# Altium project SLAVE.PrjPcb
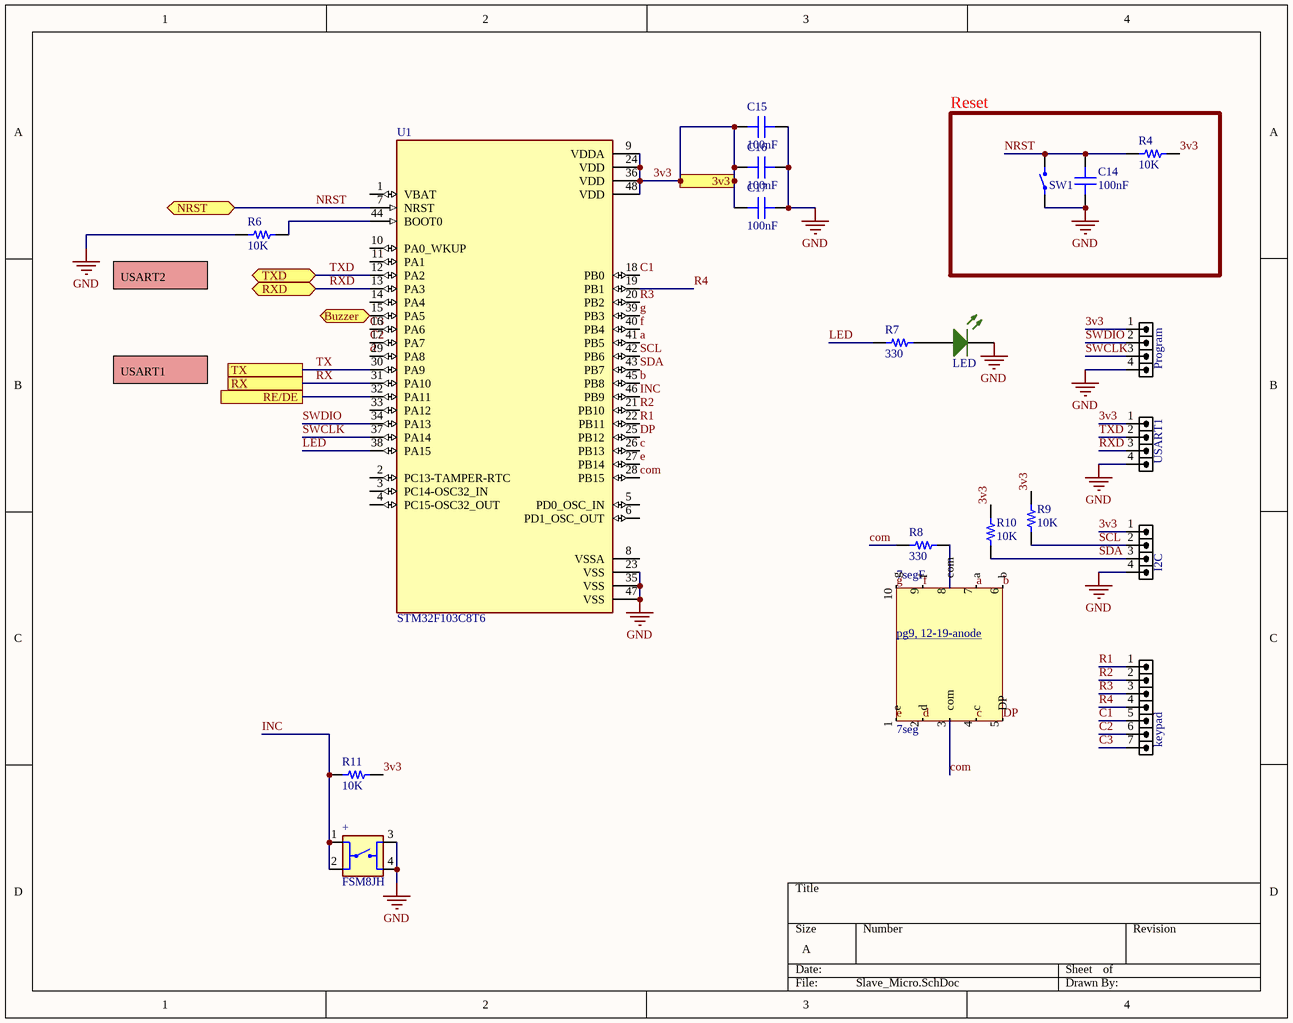
[diagram p0: Slave_Micro.SchDoc]
5 sheets, 57 parts. Net scope: flat (ports and power ports of the same name join across sheets).
Board file: SLAVE.PcbDoc
Sheets:
  Slave_Micro.SchDoc
  CH340G.SchDoc
  MAX485.SchDoc
  Supply 5V to 3V3- Ams1117.SchDoc
  Buzzer.SchDoc

## Sheet Slave_Micro.SchDoc
size A

### Parts
7seg  7seg  [PCBComponent_1]  (part F of 6)
+  FSM8JH  [SW_FSM8JH]
C14  100nF  [CAP 0805_2012]
C15  100nF  [CAP 0805_2012]
C16  100nF  [CAP 0805_2012]
C17  100nF  [CAP 0805_2012]
I2C  HDR1X4  [HDR_1X4]  (value not drawn)
keypad  HDR1X7  [HDR_1X7]  (value not drawn)
LED  LED SMD 0805 GREEN  [LED_0805_GREEN]  (value not drawn)
Program  HDR1X4  [HDR_1X4]  (value not drawn)
R4  10K  [RES 0805_2012]
R6  10K  [RES 0805_2012]
R7  330  [RES 0805_2012]
R8  330  [RES 0805_2012]
R9  10K  [RES 0805_2012]
R10  10K  [RES 0805_2012]
R11  10K  [RES 0805_2012]
SW1  Tactile 2PIN 6X3.5mm H4.57mm (SMD)  [SWPBS_SPST_6X3X5]  (value not drawn)
U1  STM32F103C8T6  [QFP50P900X900X160-48N]
USART1  HDR1X4  [HDR_1X4]  (value not drawn)

### Blocks framed on the sheet
Reset: C14 R4 SW1

### Ports
3v3 (in), Buzzer (bidir), NRST (bidir), RE/DE, RX, RXD (bidir), TX, TXD (bidir)

### Nets
GND: +.3 +.4 C14.1 C15.1 C16.1 C17.1 I2C.4 LED.2(K) Program.4 R6.1 SW1.1 U1.23(VSS) U1.35(VSS) U1.47(VSS) USART1.4
3v3: C15.2 C16.2 C17.2 I2C.1 Program.1 R4.2 R9.2 R10.2 R11.2 U1.9(VDDA) U1.24(VDD) U1.36(VDD) U1.48(VDD) USART1.1 ; port 3v3
a: 7seg.7(a) U1.41(PB5)
b: 7seg.6(b) U1.45(PB8)
c: 7seg.4(c) U1.26(PB13)
C1: keypad.5 U1.18(PB0)
C2: keypad.6 U1.17(PA7)
C3: keypad.7 U1.16(PA6)
com: 7seg.3(com) R8.1 U1.28(PB15)
d: 7seg.2(d) U1.29(PA8)
DP: 7seg.5(DP) U1.25(PB12)
e: 7seg.1(e) U1.27(PB14)
f: 7seg.9(f) U1.40(PB4)
g: 7seg.10(g) U1.39(PB3)
INC: +.1 +.2 R11.1 U1.46(PB9)
LED: R7.1 U1.38(PA15)
NRST: C14.2 R4.1 SW1.2 U1.7(NRST) ; port NRST
R1: keypad.1 U1.22(PB11)
R2: keypad.2 U1.21(PB10)
R3: keypad.3 U1.20(PB2)
R4: keypad.4 U1.19(PB1)
RX: U1.31(PA10) ; port RX
RXD: U1.13(PA3) USART1.3 ; port RXD
SCL: I2C.2 R9.1 U1.42(PB6)
SDA: I2C.3 R10.1 U1.43(PB7)
SWCLK: Program.3 U1.37(PA14)
SWDIO: Program.2 U1.34(PA13)
TX: U1.30(PA9) ; port TX
TXD: U1.12(PA2) USART1.2 ; port TXD
Net7seg_8: 7seg.8(com) R8.2
NetLED_1: LED.1(A) R7.2
NetR6_2: R6.2 U1.44(BOOT0)
NetR20_1: U1.15(PA5) ; port Buzzer
NetR66_1: U1.32(PA11) ; port RE/DE

Not connected (* = marked no-connect by the designer): U1 1(VBAT) 2(PC13-TAMPER-RTC) 3(PC14-OSC32_IN) 4(PC15-OSC32_OUT) 5(PD0_OSC_IN) 6(PD1_OSC_OUT) 8(VSSA) 10(PA0_WKUP) 11(PA1) 14(PA4) 33(PA12)

### Notes on the sheet
- (near R6) USART2
- USART1
- (in symbol 7seg, part F) pg9, 12-19-anode

### Library data of the parts
7seg = 7seg: file:///C:/Users/Tamana/Downloads/7SEG-12-19mm-GREEN-ANOD.pdf
+ = FSM8JH: Tactile Switch SPST-NO Top Actuated Through Hole; MF: TE Connectivity; Check_prices: https://www.snapeda.com/parts/FSM8JH/TE+Connectivity+ALCOSWITCH+Switches/view-part/?ref=eda; Value: *; Availability: In Stock; MP: FSM8JH; Price: None; Package: None; SnapEDA_Link: https://www.snapeda.com/parts/FSM8JH/TE+Connectivity+ALCOSWITCH+Switches/view-part/?ref=snap
C14-C17 = Cap 0805: SMT Capacitor; VALUE: 100nF
I2C Program USART1 = HDR_1X4: CONN, HEADER, Male, pitch: 2.54mm, 4POS; VALUE: HDRM4
keypad = HDR_1X7: CONN, HEADER, Male, pitch: 2.54mm, 7POS; VALUE: HDRM7
R4 R6-R11 = Res 0805: SMT Resistor; VALUE: 1K
SW1 = Tactile 2PIN 6X3.5mm H4.57mm (SMD): Tactile Switch SPST-NO Top Actuated Surface Mount; PartNumber: FSMSMTR-ND
U1 = STM32F103C8T6: ARM® Cortex®-M3 STM32F1 Microcontroller IC 32-Bit 72MHz 64KB (64K x 8) FLASH 48-LQFP (7x7); MF: STMicroelectronics; SnapEDA_Link: https://www.snapeda.com/parts/STM32F103C8T6/STMicroelectronics/view-part/?ref=snap; Package: LQFP-48 STMicroelectronics; Value: *; MP: STM32F103C8T6; Check_prices: https://www.snapeda.com/parts/STM32F103C8T6/STMicroelectronics/view-part/?ref=eda

## Sheet CH340G.SchDoc
size A
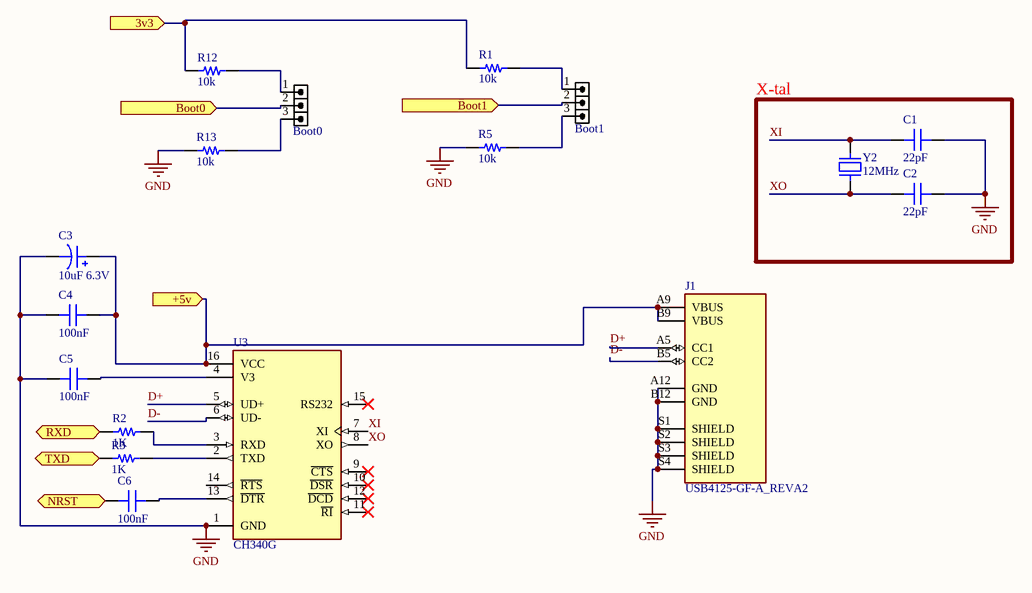
[diagram p1: CH340G.SchDoc]

### Parts
Boot0  HDRM3  [HDR_1X3]  (value not drawn)
Boot1  HDRM3  [HDR_1X3]  (value not drawn)
C1  22pF  [CAP 0805_2012]
C2  22pF  [CAP 0805_2012]
C3  10uF 6.3V  [CAP ALTH D8 L3.5 H12.5]
C4  100nF  [CAP 0805_2012]
C5  100nF  [CAP 0805_2012]
C6  100nF  [CAP 0805_2012]
J1  USB4125-GF-A_REVA2  [GCT_USB4125-GF-A_REVA2]
R1  10k  [RES 0805_2012]
R2  1K  [RES 0805_2012]
R3  1K  [RES 0805_2012]
R5  10k  [RES 0805_2012]
R12  10k  [RES 0805_2012]
R13  10k  [RES 0805_2012]
U3  CH340G  [SOIC127P600X180-16N]
Y2  12MHz  [HC-49S SMD]

### Blocks framed on the sheet
X-tal: C1 C2 Y2

### Ports
3v3 (in), +5v (in), Boot0 (in), Boot1 (in), NRST (bidir), RXD (bidir), TXD (bidir)

### Nets
GND: C1.2 C2.2 C3.2 C4.2 C5.1 J1.A12(GND) J1.B12(GND) J1.S1(SHIELD) J1.S2(SHIELD) J1.S3(SHIELD) J1.S4(SHIELD) R5.1 R13.1 U3.1(GND)
3v3: R1.1 R12.1 ; port 3v3
D+: J1.A5(CC1) U3.5(UD+)
D-: J1.B5(CC2) U3.6(UD-)
NRST: C6.1 ; port NRST
RXD: R2.1 ; port RXD
TXD: R3.1 ; port TXD
XI: C1.1 U3.7(XI) Y2.2
XO: C2.1 U3.8(XO) Y2.1
NetBoot0_1: Boot0.1 R12.2
NetBoot0_2: Boot0.2 ; port Boot0
NetBoot0_3: Boot0.3 R13.2
NetBoot1_1: Boot1.1 R1.2
NetBoot1_2: Boot1.2 ; port Boot1
NetBoot1_3: Boot1.3 R5.2
NetC3_1: C3.1 C4.1 J1.A9(VBUS) J1.B9(VBUS) U3.16(VCC) ; port +5v
NetC5_2: C5.2 U3.4(V3)
NetC6_2: C6.2 U3.13(~{DTR})
NetR2_2: R2.2 U3.3(RXD)
NetR3_2: R3.2 U3.2(TXD)

Not connected (* = marked no-connect by the designer): U3 9(~{CTS})* 10(~{DSR})* 11(~{RI})* 12(~{DCD})* 14(~{RTS}) 15(RS232)*

### Library data of the parts
Boot0 Boot1 = HDR_1X3: CONN, HEADER, Male, pitch: 2.54mm, 3POS; VALUE: HDRM3
C1 C2 = Cap 0805: SMT Capacitor; VALUE: 100nF
C3 = Cap Alu TH D8mm L3.5mm H12.5mm: TH Aluminum Polymer Capacitor; VALUE: 10uF 6.3V
C4-C6 = Cap 0805: SMT Capacitor; VALUE: 100nF
R1 R5 R12 R13 = Res 0805: SMT Resistor; VALUE: 1K
R2 R3 = Res 0805: SMT Resistor; VALUE: 1K
U3 = CH340G: USB Interface Integrated Circuit; MF: WCH; Value: *; SnapEDA_Link: https://www.snapeda.com/parts/Ch340G/WCH/view-part/?ref=snap; MP: Ch340G; Check_prices: https://www.snapeda.com/parts/Ch340G/WCH/view-part/?ref=eda; Availability: Not in stock; Price: None; Package: None
Y2 = Crystal HC-49S SMD 8MHz: SMT Crystal; PartNumber: ABLS-8.000MHZ-K4T
J1 = USB4125-GF-A_REVA2: Package: None; Availability: Unavailable; MP: USB4125-GF-A_REVA2; Value: *; Price: None

## Sheet MAX485.SchDoc
size A
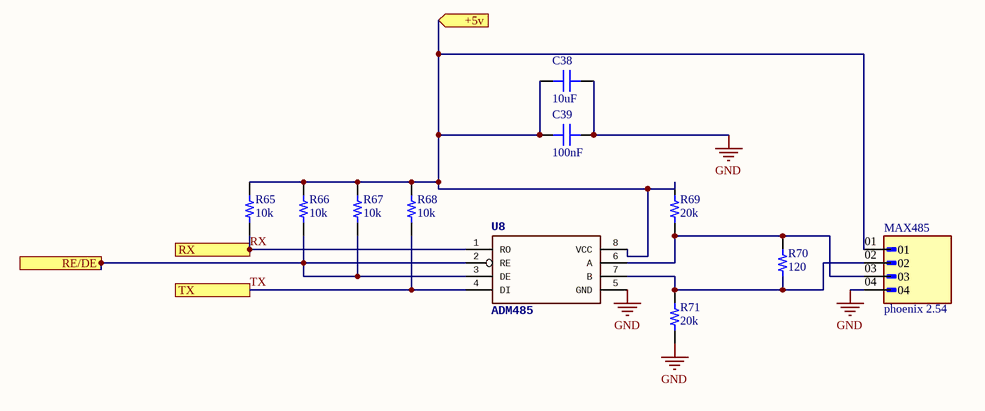
[diagram p2: MAX485.SchDoc]

### Parts
C38  10uF  [CAP 0805_2012]
C39  100nF  [CAP 0805_2012]
MAX485  phoenix 2.54  [PHOENIX_1881574]
R65  10k  [RES 0805_2012]
R66  10k  [RES 0805_2012]
R67  10k  [RES 0805_2012]
R68  10k  [RES 0805_2012]
R69  20k  [RES 0805_2012]
R70  120  [RES 0805_2012]
R71  20k  [RES 0805_2012]
U8  ADM485  [SOIC-8 4.9X3.9MM P1.27MM]

### Ports
+5v (in), RE/DE, RX, TX

### Nets
GND: C38.2 C39.2 MAX485.04 R71.1 U8.5(GND)
RX: R65.1 U8.1(RO) ; port RX
TX: R68.1 U8.4(DI) ; port TX
NetC3_1: C38.1 C39.1 MAX485.01 R65.2 R66.2 R67.2 R68.2 R69.2 U8.8(VCC) ; port +5v
NetMAX485_02: MAX485.02 R70.1 R71.2 U8.7(B)
NetMAX485_03: MAX485.03 R69.1 R70.2 U8.6(A)
NetR66_1: R66.1 R67.1 U8.2(RE) U8.3(DE) ; port RE/DE

### Library data of the parts
C38 = Cap 0805: SMT Capacitor; VALUE: 100nF
C39 = Cap 0805: SMT Capacitor; VALUE: 100nF
MAX485 = 1881574: MF: {'manufacturer': u'Phoenix Contact'}; Package: None; Price: None; Value: *; MP: 1881574; Availability: Unavailable
R65-R71 = Res 0805: SMT Resistor; VALUE: 1K
U8 = ADM485 (SMD): RS485 Interface; PartNumber: ADM4853ARZ-REEL7

## Sheet Supply 5V to 3V3- Ams1117.SchDoc
size A
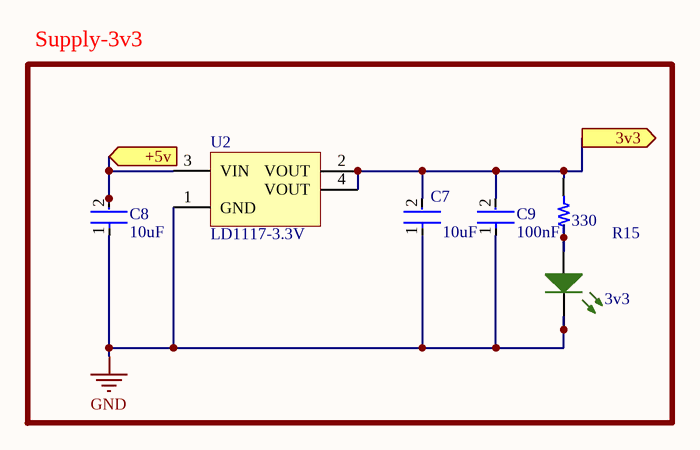
[diagram p3: Supply 5V to 3V3- Ams1117.SchDoc]

### Parts
3v3  LED SMD 0805 GREEN  [LED_0805_GREEN]  (value not drawn)
C7  10uF  [FP-C0805C-DN-MFG]
C8  10uF  [FP-C0805C-DN-IPC_B]
C9  100nF  [FP-C0805C-DN-IPC_B]
R15  330  [RES 0805_2012]
U2  LD1117-3.3V  [SOT-223-4 6.5X7MM P2.3MM]

### Blocks framed on the sheet
Supply-3v3: 3v3 C7-C9 R15 U2

### Ports
3v3 (out), +5v (in)

### Nets
GND: 3v3.2(K) C7.1 C8.1 C9.1 U2.1(GND)
3v3: C7.2 C9.2 R15.1 U2.2(VOUT) U2.4(VOUT) ; port 3v3
Net3v3_1: 3v3.1(A) R15.2
NetC3_1: C8.2 U2.3(VIN) ; port +5v

### Library data of the parts
C7-C9 = CMP-1036-04552-2: CAP CER 0.22UF 50V X7R 0805; Manufacturer: KEMET; Manufacturer Part Number: C0805C224K5RACTU; Value: 0.22 μF; Temperature Coefficient: 30ppm/°C; Material: Ceramic; Tolerance: 0.1; ComponentLink2URL: https://content.kemet.com/datasheets/KEM_C1003_C0G_SMD.pdf; Temperature Characteristic: X7R; Device Class L3: Ceramic Capacitors; Lead Free: Yes; Temperature: -55°C to +125°C; RoHS: TRUE; Capacitance: 0.22 μF; Automotive: No; Octopart: https://octopart.com/c0805c224k5ractu-kemet-144670; Temperature Range Low: -55°C; Height: 0.88mm; Device Class L1: Passive Components; Digikey Description: CAP CER 0.22UF 50V X7R 0805; ComponentLink2Description: Datasheet; Mouser Description: CAP CER 0.22UF 50V X7R 0805; Category: Cap; Ipc Land Pattern Name: CAPC200125X78; Temperature Range High: +125°C; Package: C0805C-DN; Device Class L2: Capacitors; Voltage Rating: 50 V
R15 = Res 0805: SMT Resistor; VALUE: 1K
U2 = LD1117-3.3V (SMD SOT-223): Linear Voltage Regulator IC  1 Output  800mA SOT-223; PartNumber: LD1117S33CTR

## Sheet Buzzer.SchDoc
size A4
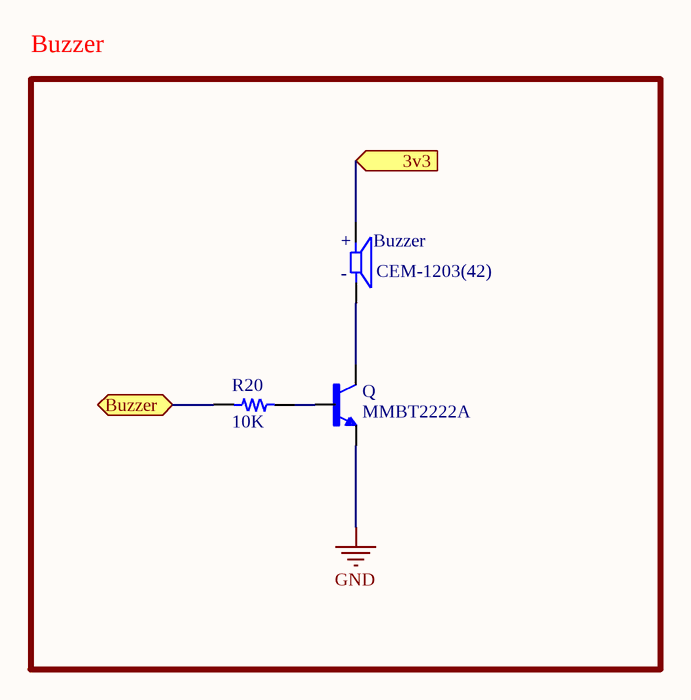
[diagram p4: Buzzer.SchDoc]

### Parts
Buzzer  CEM-1203(42)  [CUI_CEM-1203(42)]
Q  MMBT2222A  [SOT23]
R20  10K  [RES 0805_2012]

### Blocks framed on the sheet
Buzzer: Buzzer Q R20

### Ports
3v3 (in), Buzzer (bidir)

### Nets
GND: Q.2(E)
3v3: Buzzer.P ; port 3v3
NetBuzzer_N: Buzzer.N Q.3(C)
NetQ_1: Q.1(B) R20.2
NetR20_1: R20.1 ; port Buzzer

### Notes on the sheet
- Title
- Size:
- Date:
- A4
- Number:
- Time:
- Revision:
- Sheet
- of
- File:
- (in symbol CEM-1203(42)) +; -

### Library data of the parts
Buzzer = CEM-1203(42): 12 mm, 3.5 V, 85 dB, Through Hole, Magnetic Audio Transducer Buzzer; MF: CUI Devices; Package: None; Price: None; Check_prices: https://www.snapeda.com/parts/CEM-1203(42)/CUI+Devices/view-part/?ref=eda; Value: *; CUI_purchase_URL: https://www.cuidevices.com/product/audio/buzzers/audio-transducers/cem-1203(42)?utm_source=snapeda.com&utm_medium=referral&utm_campaign=snapedaBOM; SnapEDA_Link: https://www.snapeda.com/parts/CEM-1203(42)/CUI+Devices/view-part/?ref=snap; MP: CEM-1203(42); Availability: In Stock; Purchase-URL: https://pricing.snapeda.com/search/part/CEM-1203(42)/?ref=eda
Q = MMBT2222A: Bipolar _BJT_ Transistor NPN 40V 600mA 270MHz 350mW Surface Mount SOT-23-3; MF: STMicroelectronics; Package: TO-236-3 Taitron; Availability: Unavailable; MP: MMBT2222A; Value: *; SnapEDA_Link: https://www.snapeda.com/parts/MMBT2222A/STMicroelectronics/view-part/1642048/?ref=snap; Price: None
R20 = Res 0805: SMT Resistor; VALUE: 1K

## Nets that join several sheets
GND: Slave_Micro (15 pins), CH340G (14 pins), MAX485 (5 pins), Supply 5V to 3V3- Ams1117 (5 pins), Buzzer (Q.2)
3v3: Slave_Micro (14 pins), CH340G (R1.1 R12.1), Supply 5V to 3V3- Ams1117 (5 pins), Buzzer (Buzzer.P)
NetC3_1: CH340G (5 pins), MAX485 (9 pins), Supply 5V to 3V3- Ams1117 (C8.2 U2.3)
NetR20_1: Slave_Micro (U1.15), Buzzer (R20.1)
NetR66_1: Slave_Micro (U1.32), MAX485 (R66.1 R67.1 U8.2 U8.3)
NRST: Slave_Micro (C14.2 R4.1 SW1.2 U1.7), CH340G (C6.1)
RX: Slave_Micro (U1.31), MAX485 (R65.1 U8.1)
RXD: Slave_Micro (U1.13 USART1.3), CH340G (R2.1)
TX: Slave_Micro (U1.30), MAX485 (R68.1 U8.4)
TXD: Slave_Micro (U1.12 USART1.2), CH340G (R3.1)